# Altium schematic sheet Hierarchal.SchDoc
size A; SheetNumber: 1; SheetTotal: 4
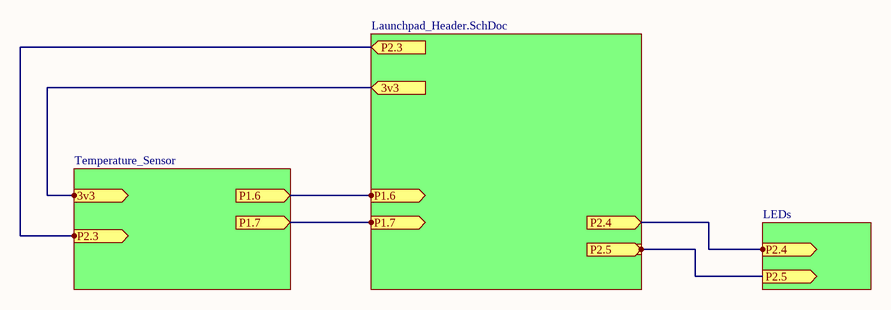
[diagram p0: Hierarchal.SchDoc]

## Sub-sheets
Designator = Launchpad_Header.SchDoc: P2.5, P1.6, P1.7
Designator = Temperature_Sensor: 3v3, P2.3
Designator = LEDs: P2.4

## Ports
3v3 (in), 3v3 (out), P1.6 (in), P1.6 (out), P1.7 (in), P1.7 (out), P2.3 (in), P2.3 (out), P2.4 (in), P2.4 (out), P2.5 (in), P2.5 (out)

## Nets
3v3: port 3v3, sheet Designator/3v3
P1.6: port P1.6, sheet Designator/P1.6
P1.7: port P1.7, sheet Designator/P1.7
P2.3: port P2.3, sheet Designator/P2.3
P2.4: port P2.4, sheet Designator/P2.4
P2.5: port P2.5, sheet Designator/P2.5